# EAGLE design pw_dist_v2 (EAGLE 9.6.2)
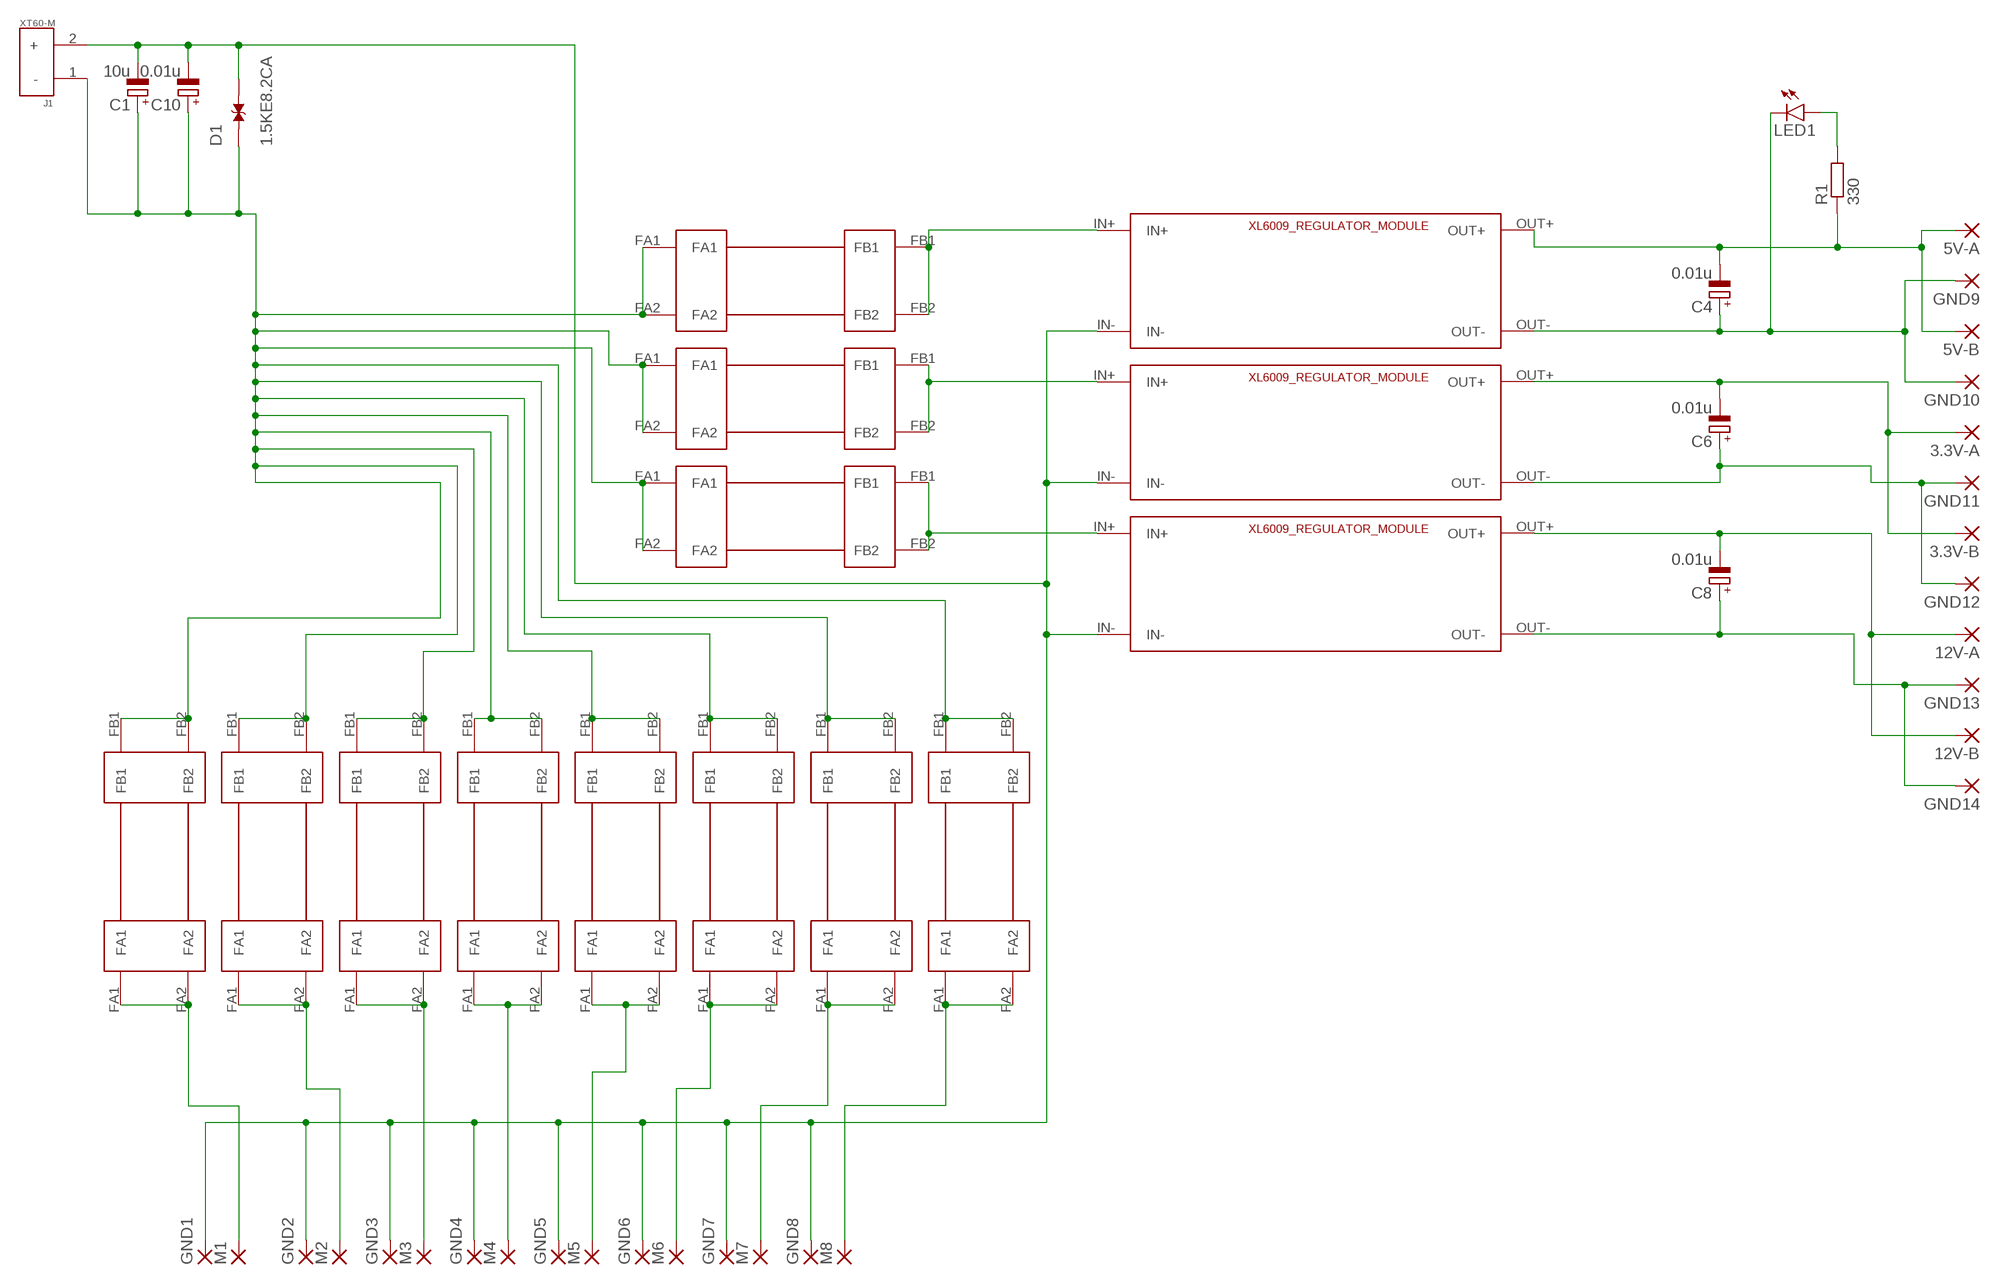
[diagram p0: schematic, sheet 1]

## Parts
3.3V-A  SMD5  [SMD2,54-5,08]
3.3V-B  SMD5  [SMD2,54-5,08]
5V-A  SMD5  [SMD2,54-5,08]
5V-B  SMD5  [SMD2,54-5,08]
12V-A  SMD5  [SMD2,54-5,08]
12V-B  SMD5  [SMD2,54-5,08]
C1  10u  CPOL-EUE5-10.5  [E5-10,5]
C4  0.01u  CPOL-EUE5-10.5  [E5-10,5]
C6  0.01u  CPOL-EUE5-10.5  [E5-10,5]
C8  0.01u  CPOL-EUE5-10.5  [E5-10,5]
C10  0.01u  CPOL-EUE5-10.5  [E5-10,5]
D1  1.5KE8.2CA  [DIOAD1586W101L900D530]
GND1  SMD5  [SMD2,54-5,08]
GND2  SMD5  [SMD2,54-5,08]
GND3  SMD5  [SMD2,54-5,08]
GND4  SMD5  [SMD2,54-5,08]
GND5  SMD5  [SMD2,54-5,08]
GND6  SMD5  [SMD2,54-5,08]
GND7  SMD5  [SMD2,54-5,08]
GND8  SMD5  [SMD2,54-5,08]
GND9  SMD5  [SMD2,54-5,08]
GND10  SMD5  [SMD2,54-5,08]
GND11  SMD5  [SMD2,54-5,08]
GND12  SMD5  [SMD2,54-5,08]
GND13  SMD5  [SMD2,54-5,08]
GND14  SMD5  [SMD2,54-5,08]
J1  XT60-M  [AMASS_XT60-M]
LED1  LED5MM  [LED5MM]
M1  SMD5  [SMD2,54-5,08]
M2  SMD5  [SMD2,54-5,08]
M3  SMD5  [SMD2,54-5,08]
M4  SMD5  [SMD2,54-5,08]
M5  SMD5  [SMD2,54-5,08]
M6  SMD5  [SMD2,54-5,08]
M7  SMD5  [SMD2,54-5,08]
M8  SMD5  [SMD2,54-5,08]
R1  330  R-EU_0207/10  [0207/10]
U$1  XL6009_MODULE  [XL6009_MODULE]
U$2  XL6009_MODULE  [XL6009_MODULE]
U$3  XL6009_MODULE  [XL6009_MODULE]
U$4  FUSE_HOLDER_2  [FUSE_HOLDER_2]
U$5  FUSE_HOLDER_2  [FUSE_HOLDER_2]
U$6  FUSE_HOLDER_2  [FUSE_HOLDER_2]
U$7  FUSE_HOLDER_2  [FUSE_HOLDER_2]
U$8  FUSE_HOLDER_2  [FUSE_HOLDER_2]
U$9  FUSE_HOLDER_2  [FUSE_HOLDER_2]
U$10  FUSE_HOLDER_2  [FUSE_HOLDER_2]
U$11  FUSE_HOLDER_2  [FUSE_HOLDER_2]
U$12  FUSE_HOLDER_2  [FUSE_HOLDER_2]
U$13  FUSE_HOLDER_2  [FUSE_HOLDER_2]
U$14  FUSE_HOLDER_2  [FUSE_HOLDER_2]

## Nets
N$1: U$2.IN+ U$4.FB1 U$4.FB2
N$2: U$1.IN+ U$5.FB1 U$5.FB2
N$3: U$3.IN+ U$6.FB1 U$6.FB2
N$4: C1.- C10.- D1.2 GND1.1(P) GND2.1(P) GND3.1(P) GND4.1(P) GND5.1(P) GND6.1(P) GND7.1(P) GND8.1(P) J1.2(+) U$1.IN- U$2.IN- U$3.IN-
N$5: M1.1(P) U$14.FA1 U$14.FA2
N$6: M2.1(P) U$13.FA1 U$13.FA2
N$7: M3.1(P) U$12.FA1 U$12.FA2
N$8: M4.1(P) U$11.FA1 U$11.FA2
N$9: M5.1(P) U$10.FA1 U$10.FA2
N$10: M6.1(P) U$9.FA1 U$9.FA2
N$11: M7.1(P) U$8.FA1 U$8.FA2
N$12: C1.+ C10.+ D1.1 J1.1(-) U$4.FA1 U$4.FA2 U$5.FA1 U$5.FA2 U$6.FA1 U$6.FA2 U$7.FB1 U$7.FB2 U$8.FB1 U$8.FB2 U$9.FB1 U$9.FB2 U$10.FB1 U$10.FB2 U$11.FB1 U$11.FB2 U$12.FB1 U$12.FB2 U$13.FB1 U$13.FB2 U$14.FB1 U$14.FB2
N$13: M8.1(P) U$7.FA1 U$7.FA2
N$14: 5V-A.1(P) 5V-B.1(P) C4.- R1.1 U$2.OUT+
N$15: C4.+ GND9.1(P) GND10.1(P) LED1.K(C) U$2.OUT-
N$16: 3.3V-A.1(P) 3.3V-B.1(P) C6.- U$1.OUT+
N$17: C6.+ GND11.1(P) GND12.1(P) U$1.OUT-
N$18: 12V-A.1(P) 12V-B.1(P) C8.- U$3.OUT+
N$19: C8.+ GND13.1(P) GND14.1(P) U$3.OUT-
N$20: LED1.A R1.2

## Library data of the parts
3.3V-A 3.3V-B 5V-A 5V-B 12V-A 12V-B GND1-GND14 M1-M8 = wirepad:SMD5: SMD PAD
C1 C4 C6 C8 C10 = rcl:CPOL-EU: POLARIZED CAPACITOR, European symbol; SPICEPREFIX: C
D1 = 1.5KE8.2CA:1.5KE8.2CA: Check availability <https://pricing.snapeda.com/parts/1.5KE8.2CA/Taiwan%20Semiconductor/view-part?ref=eda>; AVAILABILITY: In Stock; DESCRIPTION: 1500W, 8.2V, 5%, Bidirectional, TVS; MF: Taiwan Semiconductor; MP: 1.5KE8.2CA; PACKAGE: DO-201 Taiwan Semiconductor; PRICE: None; PURCHASE-URL: https://pricing.snapeda.com/search/part/1.5KE8.2CA/?ref=eda
J1 = XT60-M:XT60-M: DC supply; XT60; male; PIN:2; for cable; soldered; 60A; 500V Check availability <https://pricing.snapeda.com/parts/XT60-M/AMASS/view-part?ref=eda>; AVAILABILITY: Not in stock; DESCRIPTION: Plug; DC supply; XT60; male; PIN: 2; for cable; soldered; 30A; 500V; MF: AMASS; MP: XT60-M; PACKAGE: Package; PRICE: None
LED1 = led:LED: LED OSRAM: - CHIPLED LG R971, LG N971, LY N971, LG Q971, LY Q971, LO R971, LY R971 LH N974, LH R974 LS Q976, LO Q976, LY Q976 LO Q996 - Hyper CHIPLED LW Q18S LB Q993, LB Q99A, LB R99A - SideLED LS A670, LO A670, LY A670, LG A670, LP A670 LB A673, LV A673, LT A673, LW A673 LH A674 LY A675 LS A676, LA A676, LO A676, LY A676, LW A676 LS A679, LY A679, LG A679 - Hyper Micro SIDELED® LS Y876, LA Y876, LO Y876, LY Y876 LT Y87S - SmartLED LW L88C, LW L88S LB L89C, LB L89S, LG L890 LS L89K, LO L89K, LY L89K LS L896, LA L896, LO L896, LY L896 - TOPLED LS T670, LO T670, LY T670, LG T670, LP T670 LSG T670, LSP T670, LSY T670, LOP T670, LYG T670 LG T671, LOG T671, LSG T671 LB T673, LV T673, LT T673, LW T673 LH T674 LS T676, LA T676, LO T676, LY T676, LB T676, LH T676, LSB T676, LW T676 LB T67C, LV T67C, LT T67C, LS T67K, LO T67K, LY T67K, LW E67C LS E67B, LA E67B, LO E67B, LY E67B, LB E67C, LV E67C, LT E67C LW T67C LS T679, LY T679, LG T679 LS T770, LO T770, LY T770, LG T770, LP T770 LB T773, LV T773, LT T773, LW T773 LH T774 LS E675, LA E675, LY E675, LS T675 LS T776, LA T776, LO T776, LY T776, LB T776 LHGB T686 LT T68C, LB T68C - Hyper Mini TOPLED® LB M676 - Mini TOPLED Santana® LG M470 LS M47K, LO M47K, LY M47K Source: http://www.osram.convergy.de LUXEON: - LUMILED® LXK2-PW12-R00, LXK2-PW12-S00, LXK2-PW14-U00, LXK2-PW14-V00 LXK2-PM12-R00, LXK2-PM12-S00, LXK2-PM14-U00 LXK2-PE12-Q00, LXK2-PE12-R00, LXK2-PE12-S00, LXK2-PE14-T00, LXK2-PE14-U00 LXK2-PB12-K00, LXK2-PB12-L00, LXK2-PB12-M00, LXK2-PB14-N00, LXK2-PB14-P00, LXK2-PB14-Q00 LXK2-PR12-L00, LXK2-PR12-M00, LXK2-PR14-Q00, LXK2-PR14-R00 LXK2-PD12-Q00, LXK2-PD12-R00, LXK2-PD12-S00 LXK2-PH12-R00, LXK2-PH12-S00 LXK2-PL12-P00, LXK2-PL12-Q00, LXK2-PL12-R00 Source: www.luxeon.com KINGBRIGHT: KA-3528ASYC Source: www.kingbright.com
R1 = rcl:R-EU_: RESISTOR, European symbol; SPICEPREFIX: R
U$1-U$3 = power_dist:XL6009_MODULE
U$4-U$14 = power_dist:FUSE_HOLDER_2

## Board
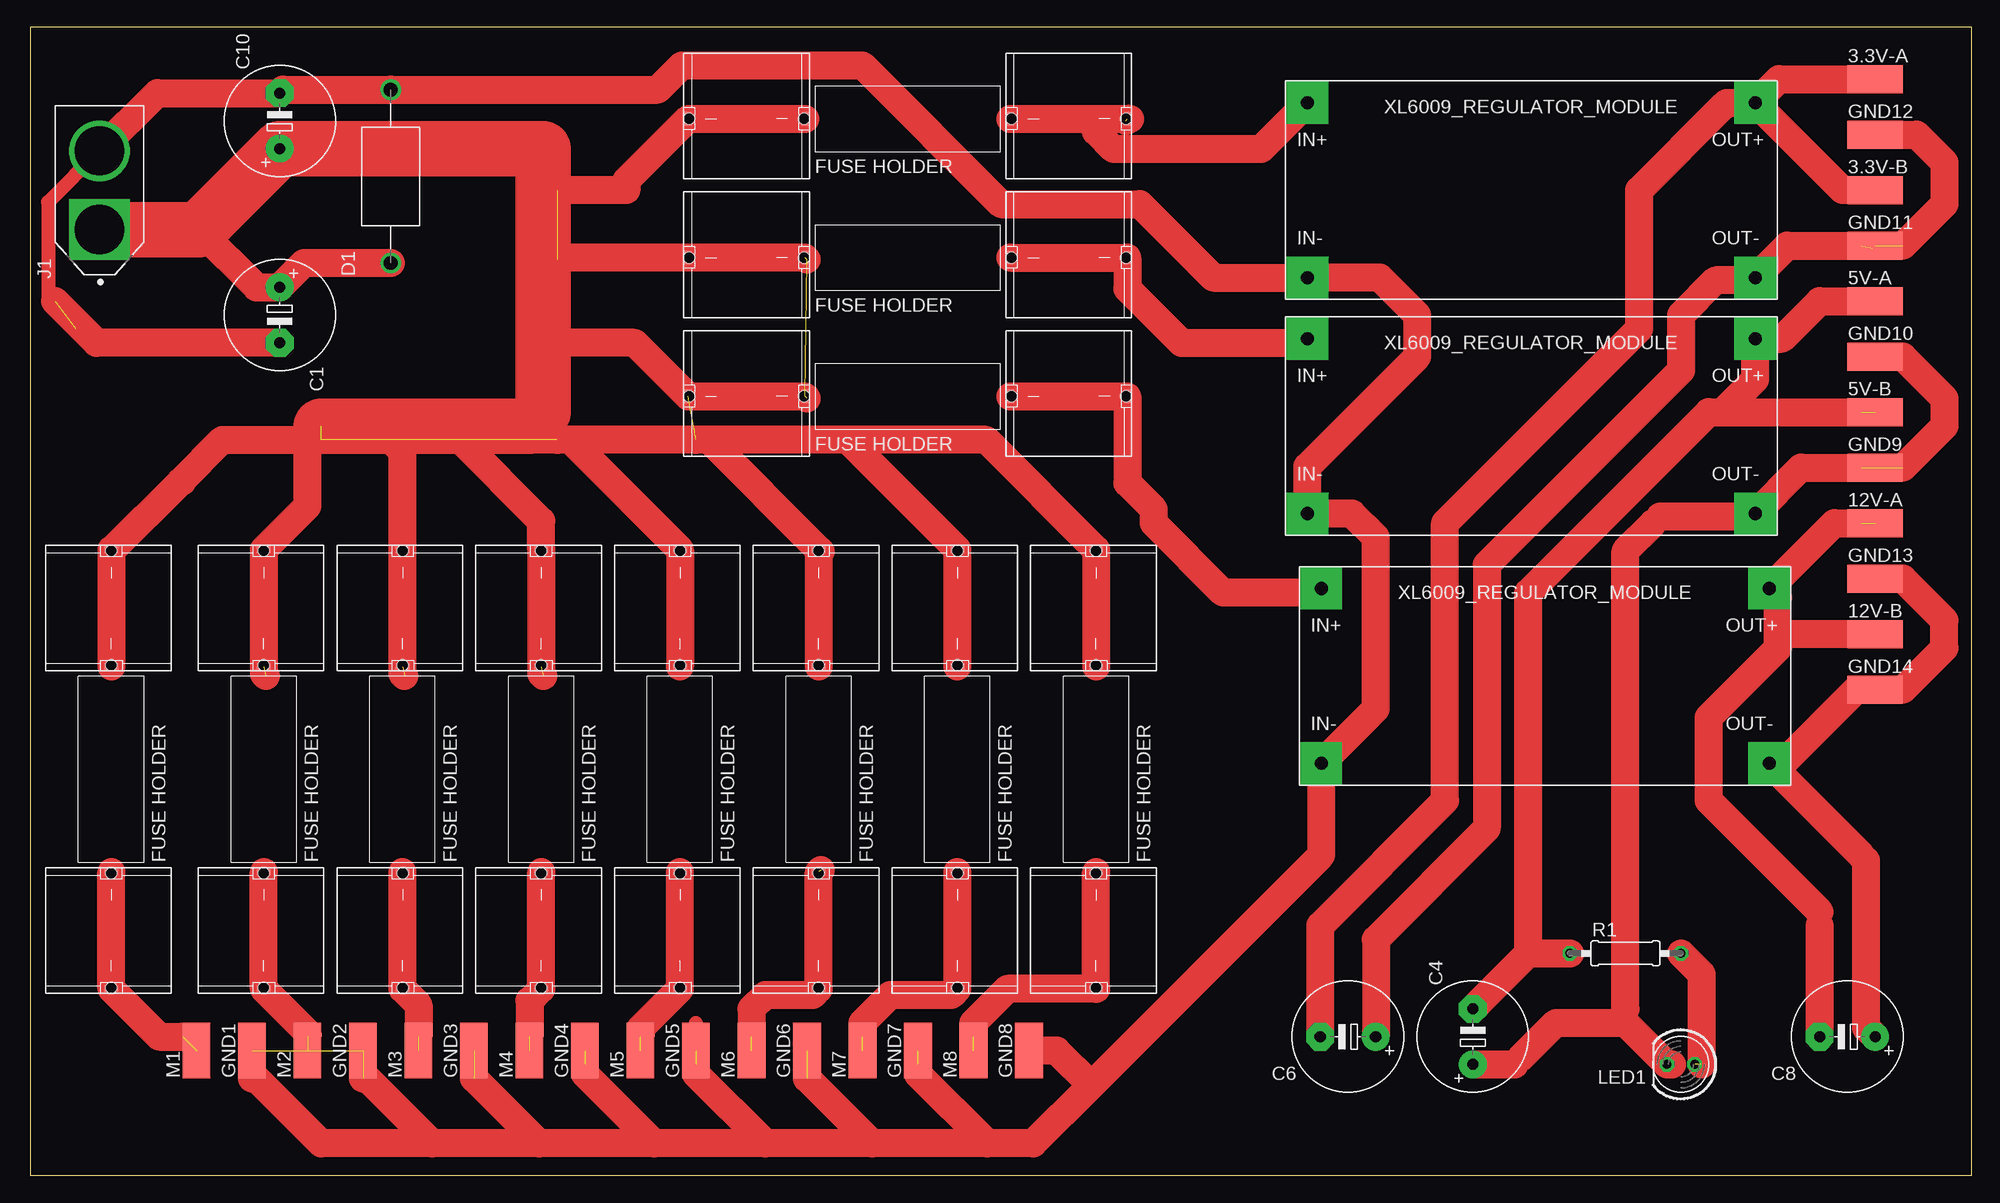
[diagram p1: board, top side]

Size 177.78 x 105.08 mm. Coordinates in mm from the lower left corner, seen from the top.
Outline: 0,0 177.78,0 177.78,105.08 0,105.08 0,0
Copper layers (1*16): Top 0.035mm / dielectric 1.5mm / Bottom 0.035mm
Design rules "default": minimum track width 6mil, minimum drill 0.35mm, track to track 6mil, track to pad 6mil, pad to pad 6mil, via to via 6mil, smd to smd 6mil, copper to edge 40mil, drill to drill 6mil, minimum pad ring 10mil, minimum via ring 8mil, stop-mask expansion 4mil, vias tented up to drill 0mil, thermal gap 10mil

### Footprints (pad centres in the part's own frame; a part is rotated, then mirrored left to right if it is on the bottom)
SMD2,54-5,08 = smd 2.54 x 5.08: 1 0,0
E5-10,5 = drill 1.016 pad 2.54: + -2.54,0 | drill 1.016 pad 2.54 octagon: - 2.54,0
DIOAD1586W101L900D530 = drill 1.26: 1 -7.93,0; 2 7.93,0
AMASS_XT60-M = drill 4.5 square: 1 -3.6,0 | drill 4.5: 2 3.6,0
LED5MM = drill 0.813 octagon: A -1.27,0; K 1.27,0
0207/10 = drill 0.813 octagon: 1 -5.08,0; 2 5.08,0
XL6009_MODULE = drill 1.2 pad 3.81 square: IN+ -38,8; IN- -38,-8; OUT+ 3,8; OUT- 3,-8
FUSE_HOLDER_2 = smd 0.635 x 1.27: FA1 -9.6,4; FA2 1.1,4; FB1 19.9,4; FB2 30.6,4 | hole 1: -9.5,4; 1,4; 20,4; 30.5,4

### Placement (x,y rotation side)
3.3V-A  168.91,100.33 270 top
3.3V-B  168.91,90.17 270 top
5V-A  168.91,80.01 270 top
5V-B  168.91,69.85 270 top
12V-A  168.91,59.69 270 top
12V-B  168.91,49.53 270 top
C1  22.86,78.74 270 top
C4  132.08,12.7 90 top
C6  120.65,12.7 180 top
C8  166.37,12.7 180 top
C10  22.86,96.52 90 top
D1  33.02,91.44 90 top
GND1  20.32,11.43 0 top
GND2  30.48,11.43 0 top
GND3  40.64,11.43 0 top
GND4  50.8,11.43 0 top
GND5  60.96,11.43 0 top
GND6  71.12,11.43 0 top
GND7  81.28,11.43 0 top
GND8  91.44,11.43 0 top
GND9  168.91,64.77 270 top
GND10  168.91,74.93 270 top
GND11  168.91,85.09 270 top
GND12  168.91,95.25 270 top
GND13  168.91,54.61 270 top
GND14  168.91,44.45 270 top
J1  6.35,90.17 90 top
LED1  151.13,10.16 180 top
M1  15.24,11.43 0 top
M2  25.4,11.43 0 top
M3  35.56,11.43 0 top
M4  45.72,11.43 0 top
M5  55.88,11.43 0 top
M6  66.04,11.43 0 top
M7  76.2,11.43 0 top
M8  86.36,11.43 0 top
R1  146.05,20.32 0 top
U$1  154.94,90.17 0 top
U$2  154.94,68.58 0 top
U$3  156.21,45.72 0 top
U$4  69.85,80.01 0 top
U$5  69.85,92.71 0 top
U$6  69.85,67.31 0 top
U$7  101.6,26.67 90 top
U$8  88.9,26.67 90 top
U$9  76.2,26.67 90 top
U$10  63.5,26.67 90 top
U$11  50.8,26.67 90 top
U$12  38.1,26.67 90 top
U$13  25.4,26.67 90 top
U$14  11.43,26.67 90 top

### Tracks (layer width: path | path; a pad name or v marks a point on that pad's centre or on a via)
N$1
  Top 2.54: U$4.FB1 U$4.FB2 100.45,81.16 105.41,76.2 116.56,76.2 U$2.IN+
N$2  (1 unrouted)
  Top 2.54: U$5.FB1 97.56,96.71 | 97.56,96.71 100.14,96.71 100.33,96.52 | 100.71,96.71 U$5.FB2 | 97.56,96.71 97.56,95.56 99.2,93.92 112.69,93.92 U$1.IN+
N$3
  Top 2.54: U$6.FB1 U$6.FB2 100.45,63.38 102.87,60.96 102.87,59.69 109.22,53.34 117.83,53.34 U$3.IN+
N$4  (8 unrouted)
  Top 1.27: GND5.1 60.96,13.97 | GND6.1 71.12,12.7 | 92.71,11.43 GND8.1 | 22.86,6.73 22.48,6.73 20.32,8.89 | J1.2 1.65,89.07 1.65,80.01 4.19,77.47
  Top 2.54: J1.2 11.64,99.06 C10.- 23.17,99.37 D1.2 57.46,99.37 59.69,101.6 76.2,101.6 88.9,88.9 101.6,88.9 108.33,82.17 U$1.IN- 123.57,82.17 127,78.74 127,74.93 116.94,64.87 U$2.IN- 121.03,60.58 123.19,58.42 123.19,42.7 U$3.IN- 118.21,29.31 97.16,8.26 | 97.16,8.26 91.82,2.92 87.63,2.92 | 87.63,2.92 77.09,2.92 | 77.09,2.92 67.31,2.92 | 67.31,2.92 57.15,2.92 | 57.15,2.92 46.61,2.92 | 46.61,2.92 36.83,2.92 | 36.83,2.92 26.67,2.92 22.86,6.73 20.7,8.89 20.32,8.89 | 97.16,8.26 93.98,11.43 92.71,11.43 | 87.63,2.92 81.28,9.27 81.28,10.16 | 77.09,2.92 71.12,8.89 | 67.31,2.92 60.96,9.27 60.96,10.16 | 57.15,2.92 50.8,9.27 50.8,10.16 | 46.61,2.92 40.64,8.89 | 36.83,2.92 30.86,8.89 30.48,8.89 | C1.- 6.1,76.2 2.29,80.01
N$5  (1 unrouted)
  Top 2.54: 13.97,12.7 11.8,12.7 U$14.FA1 U$14.FA2
N$6  (1 unrouted)
  Top 2.54: 25.4,12.7 25.4,13.07 U$13.FA1 U$13.FA2
N$7  (1 unrouted)
  Top 2.54: 35.56,12.7 35.56,15.61 U$12.FA1 U$12.FA2
N$8  (1 unrouted)
  Top 2.54: 45.72,12.7 45.72,15.99 U$11.FA1 U$11.FA2
N$9  (1 unrouted)
  Top 2.54: 55.88,12.7 55.88,13.45 U$10.FA1 U$10.FA2
N$10  (2 unrouted)
  Top 2.54: 66.04,12.7 66.04,15.24 67.31,16.51 71.64,16.51 U$9.FA1 72.2,27.75 72.39,27.94
N$11  (1 unrouted)
  Top 2.54: 76.2,12.7 76.2,13.97 78.74,16.51 84.34,16.51 U$8.FA1 U$8.FA2
N$12  (13 unrouted)
  Top 2.54: U$14.FB2 7.43,57.15 | 7.43,57.15 U$14.FB1 | 21.59,45.72 21.4,45.91 U$13.FB2 25.4,61.27 25.4,67.31 | 34.29,45.72 34.1,45.91 U$12.FB2 34.1,66.23 33.02,67.31 | 46.99,45.72 46.8,45.91 U$11.FB2 46.8,59.88 39.37,67.31 | U$10.FB1 U$10.FB2 49.46,67.31 45.72,67.31 | 72.39,57.08 U$9.FB2 | U$8.FB1 U$8.FB2 74.86,67.31 | U$9.FB2 U$9.FB1 | U$7.FB1 U$7.FB2 87.56,67.31 74.86,67.31 | U$5.FA2 U$5.FA1 54.61,91.07 54.61,90.17 48.26,90.17 | 71.12,83.82 70.93,84.01 U$4.FA1 48.45,84.01 48.26,83.82 | 71.12,71.12 70.93,71.31 U$6.FA1 55.36,76.2 46.99,76.2 | 7.43,57.15 13.78,63.5 | 13.78,63.5 13.97,63.5 | 13.78,63.5 17.59,67.31 25.4,67.31 | 25.4,67.31 26.67,67.31 | U$9.FB2 62.16,67.31 48.26,67.31 | 74.86,67.31 60.96,67.31 | 15.45,86.57 20.74,81.28 C1.+ 25.09,83.51 D1.1
  Top 5.08: J1.1 15.45,86.57 C10.+ 46.99,93.98 46.99,76.2 46.99,69.85 45.72,68.58 26.67,68.58
N$13  (1 unrouted)
  Top 2.54: 86.36,12.7 86.36,13.97 89.46,17.07 U$7.FA1 U$7.FA2
N$14  (1 unrouted)
  Top 2.54: 154.94,69.85 153.67,69.85 137.16,53.34 137.16,20.32 | 154.94,69.85 157.94,72.85 U$2.OUT+ 160.4,76.58 163.83,80.01 5V-A.1 | 154.94,69.85 167.64,69.85 | C4.- 137.16,20.32 | 137.16,20.32 R1.1
N$15  (2 unrouted)
  Top 1.016: 146.05,13.97 146.05,15.24 | 135.89,10.16 136.53,10.79 | 148.59,59.69 149.22,60.32
  Top 2.54: C4.+ 135.89,10.16 | 136.53,10.79 139.7,13.97 146.05,13.97 LED1.K 150.32,10.16 | 146.05,15.24 146.05,57.15 148.59,59.69 | 149.22,60.32 157.69,60.32 U$2.OUT- 162.13,64.77 167.64,64.77 | GND10.1 171.45,74.93 175.26,71.12 175.26,68.58 171.45,64.77
N$16
  Top 0.508: 168.37,100.87 3.3V-A.1
  Top 1.016: 154.94,97.79 157.48,97.79
  Top 2.54: C6.- 118.11,22.86 129.54,34.29 129.54,59.69 147.32,77.47 147.32,90.17 154.94,97.79 155.32,98.17 U$1.OUT+ | 3.3V-B.1 165.94,90.17 U$1.OUT+ | U$1.OUT+ 160.1,100.33 3.3V-A.1
N$17  (2 unrouted)
  Top 1.016: GND11.1 168.69,84.87
  Top 2.54: C6.+ 123.19,21.59 133.35,31.75 133.35,55.88 151.13,73.66 151.13,78.74 154.3,81.92 157.69,81.92 U$1.OUT- 160.86,85.09 167.64,85.09 | GND12.1 172.72,95.25 175.26,92.71 175.26,88.9 171.45,85.09
N$18  (1 unrouted)
  Top 1.016: 163.83,22.86 163.83,24.13
  Top 2.54: C8.- 163.83,22.86 | 163.83,24.13 153.67,34.29 153.67,41.91 160.02,48.26 160.02,49.53 | 160.02,49.53 160.02,52.91 U$3.OUT+ 165.18,59.69 167.64,59.69 | 12V-B.1 160.02,49.53
N$19
  Top 1.016: 170.18,54.61 GND13.1 | 168.1,28.83 167.68,29.25
  Top 2.54: C8.+ 168.1,13.51 168.1,28.83 | 167.68,29.25 U$3.OUT- 160.48,37.72 167.21,44.45 GND14.1 171.45,44.45 175.26,48.26 175.26,50.8 171.45,54.61 170.18,54.61
N$20  (1 unrouted)
  Top 2.54: R1.2 153.01,18.44 153.01,10.16